# EAGLE design eeepc_usb (EAGLE 5.05)
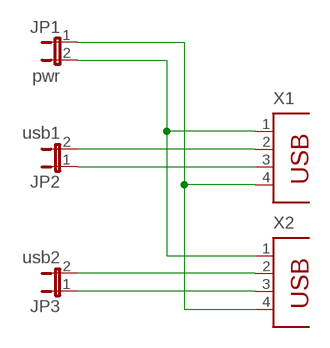
[diagram p0: schematic, sheet 1]

## Parts
JP1  pwr  JP1E  [JP1]
JP2  usb1  JP1E  [JP1]
JP3  usb2  JP1E  [JP1]
X1  PN87520  [PN87520]
X2  PN87520  [PN87520]

## Nets
N$1: JP1.2 X1.1 X2.1
N$2: JP1.1 X1.4 X2.4
N$3: JP2.2 X1.2
N$4: JP2.1 X1.3
N$5: JP3.2 X2.2
N$6: JP3.1 X2.3

## Library data of the parts
JP1-JP3 = jumper:JP1E: JUMPER
X1 X2 = con-berg:PN87520: BERG USB connector

## Board
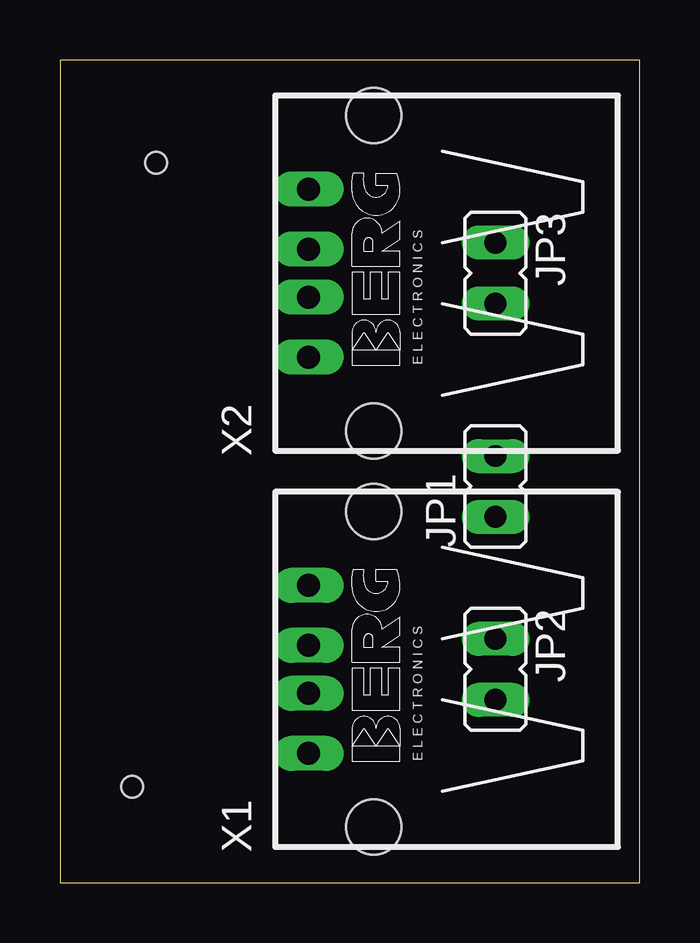
[diagram p1: board, top side]
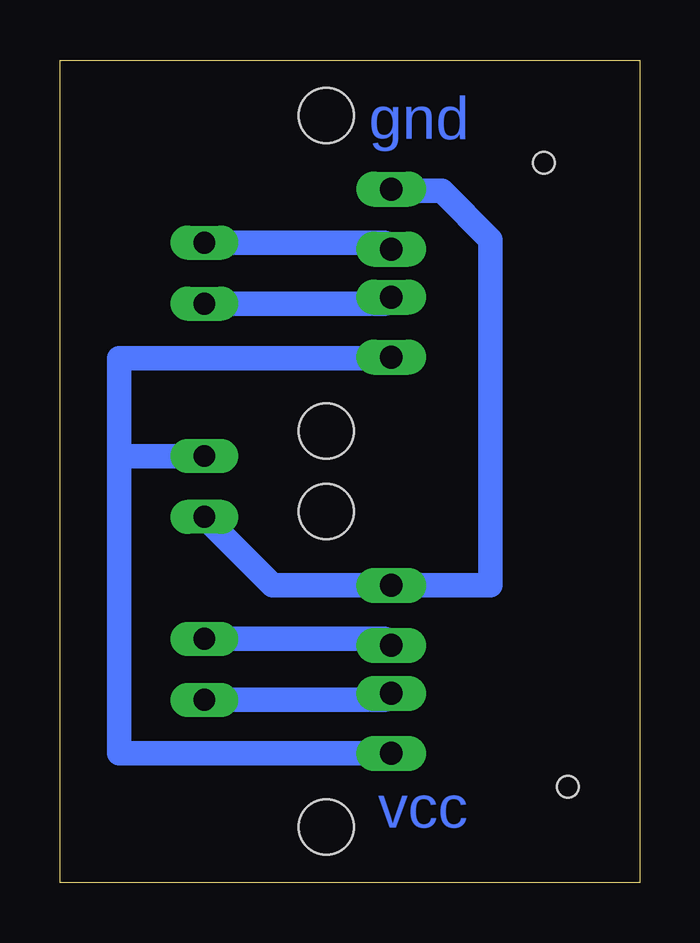
[diagram p2: board, bottom side, seen from below]

Size 24.18 x 34.28 mm. Coordinates in mm from the lower left corner, seen from the top.
Outline: 0,0 24.18,0 24.18,34.28 0,34.28 0,0
Copper layers (1*16): Top 0.035mm / dielectric 1.5mm / Bottom 0.035mm
Design rules "default": minimum track width 10mil, minimum drill 24mil, track to track 8mil, track to pad 8mil, pad to pad 8mil, via to via 8mil, smd to smd 8mil, copper to edge 40mil, drill to drill 8mil, minimum pad ring 10mil, minimum via ring 8mil, stop-mask expansion 4mil, vias tented up to drill 0mil, thermal gap 10mil
Holes 0.9 mm at 3,4 4,30

### Footprints (pad centres in the part's own frame; a part is rotated, then mirrored left to right if it is on the bottom)
JP1 = drill 0.914 long: 1 0,-1.27; 2 0,1.27
PN87520 = drill 0.95 long: 1 -3.5,2.71; 2 -1,2.71; 3 1,2.71; 4 3.5,2.71 | hole 2.3: -6.57,0; 6.57,0

### Placement (x,y rotation side)
JP1  18.16,16.51 0 top
JP2  18.16,8.89 180 top
JP3  18.16,25.4 180 top
X1  13.08,8.89 90 top
X2  13.08,25.4 90 top

### Tracks (layer width: path | path; a pad name or v marks a point on that pad's centre or on a via)
N$1
  Bottom 0.813: 10.37,21.84 X2.1 | 21.72,17.53 21.72,17.78
  Bottom 1.016: X1.1 21.72,5.39 21.72,17.53 21.72,21.84 10.37,21.84 | 21.72,17.78 JP1.2
N$2
  Bottom 1.016: JP1.1 15.31,12.39 X1.4 6.22,12.39 6.22,26.8 8.25,28.83 10.3,28.83 X2.4
N$3
  Bottom 0.406: 10.64,7.62 X1.2
  Bottom 1.016: JP2.2 10.64,7.62
N$4
  Bottom 0.406: 10.64,10.16 X1.3
  Bottom 1.016: JP2.1 10.64,10.16
N$5
  Bottom 0.406: 10.64,24.13 X2.2
  Bottom 1.016: JP3.2 10.64,24.13
N$6
  Bottom 0.406: 10.64,26.67 X2.3
  Bottom 1.016: JP3.1 10.64,26.67

### Text on the board
Bottom: gnd | vcc